# EasyEDA Pro project ProPrj_药盒0.11_2025-04-15.epro, schematic Schematic1
Board Name: Board1; Create Date: 2025-03-17; Page Name: P1; Project Name: 药盒0.11; Schematic Name: Schematic1; Update Date: 2025-03-25; Company: 嘉立创EDA; Page Size: A4; Version: V1.0
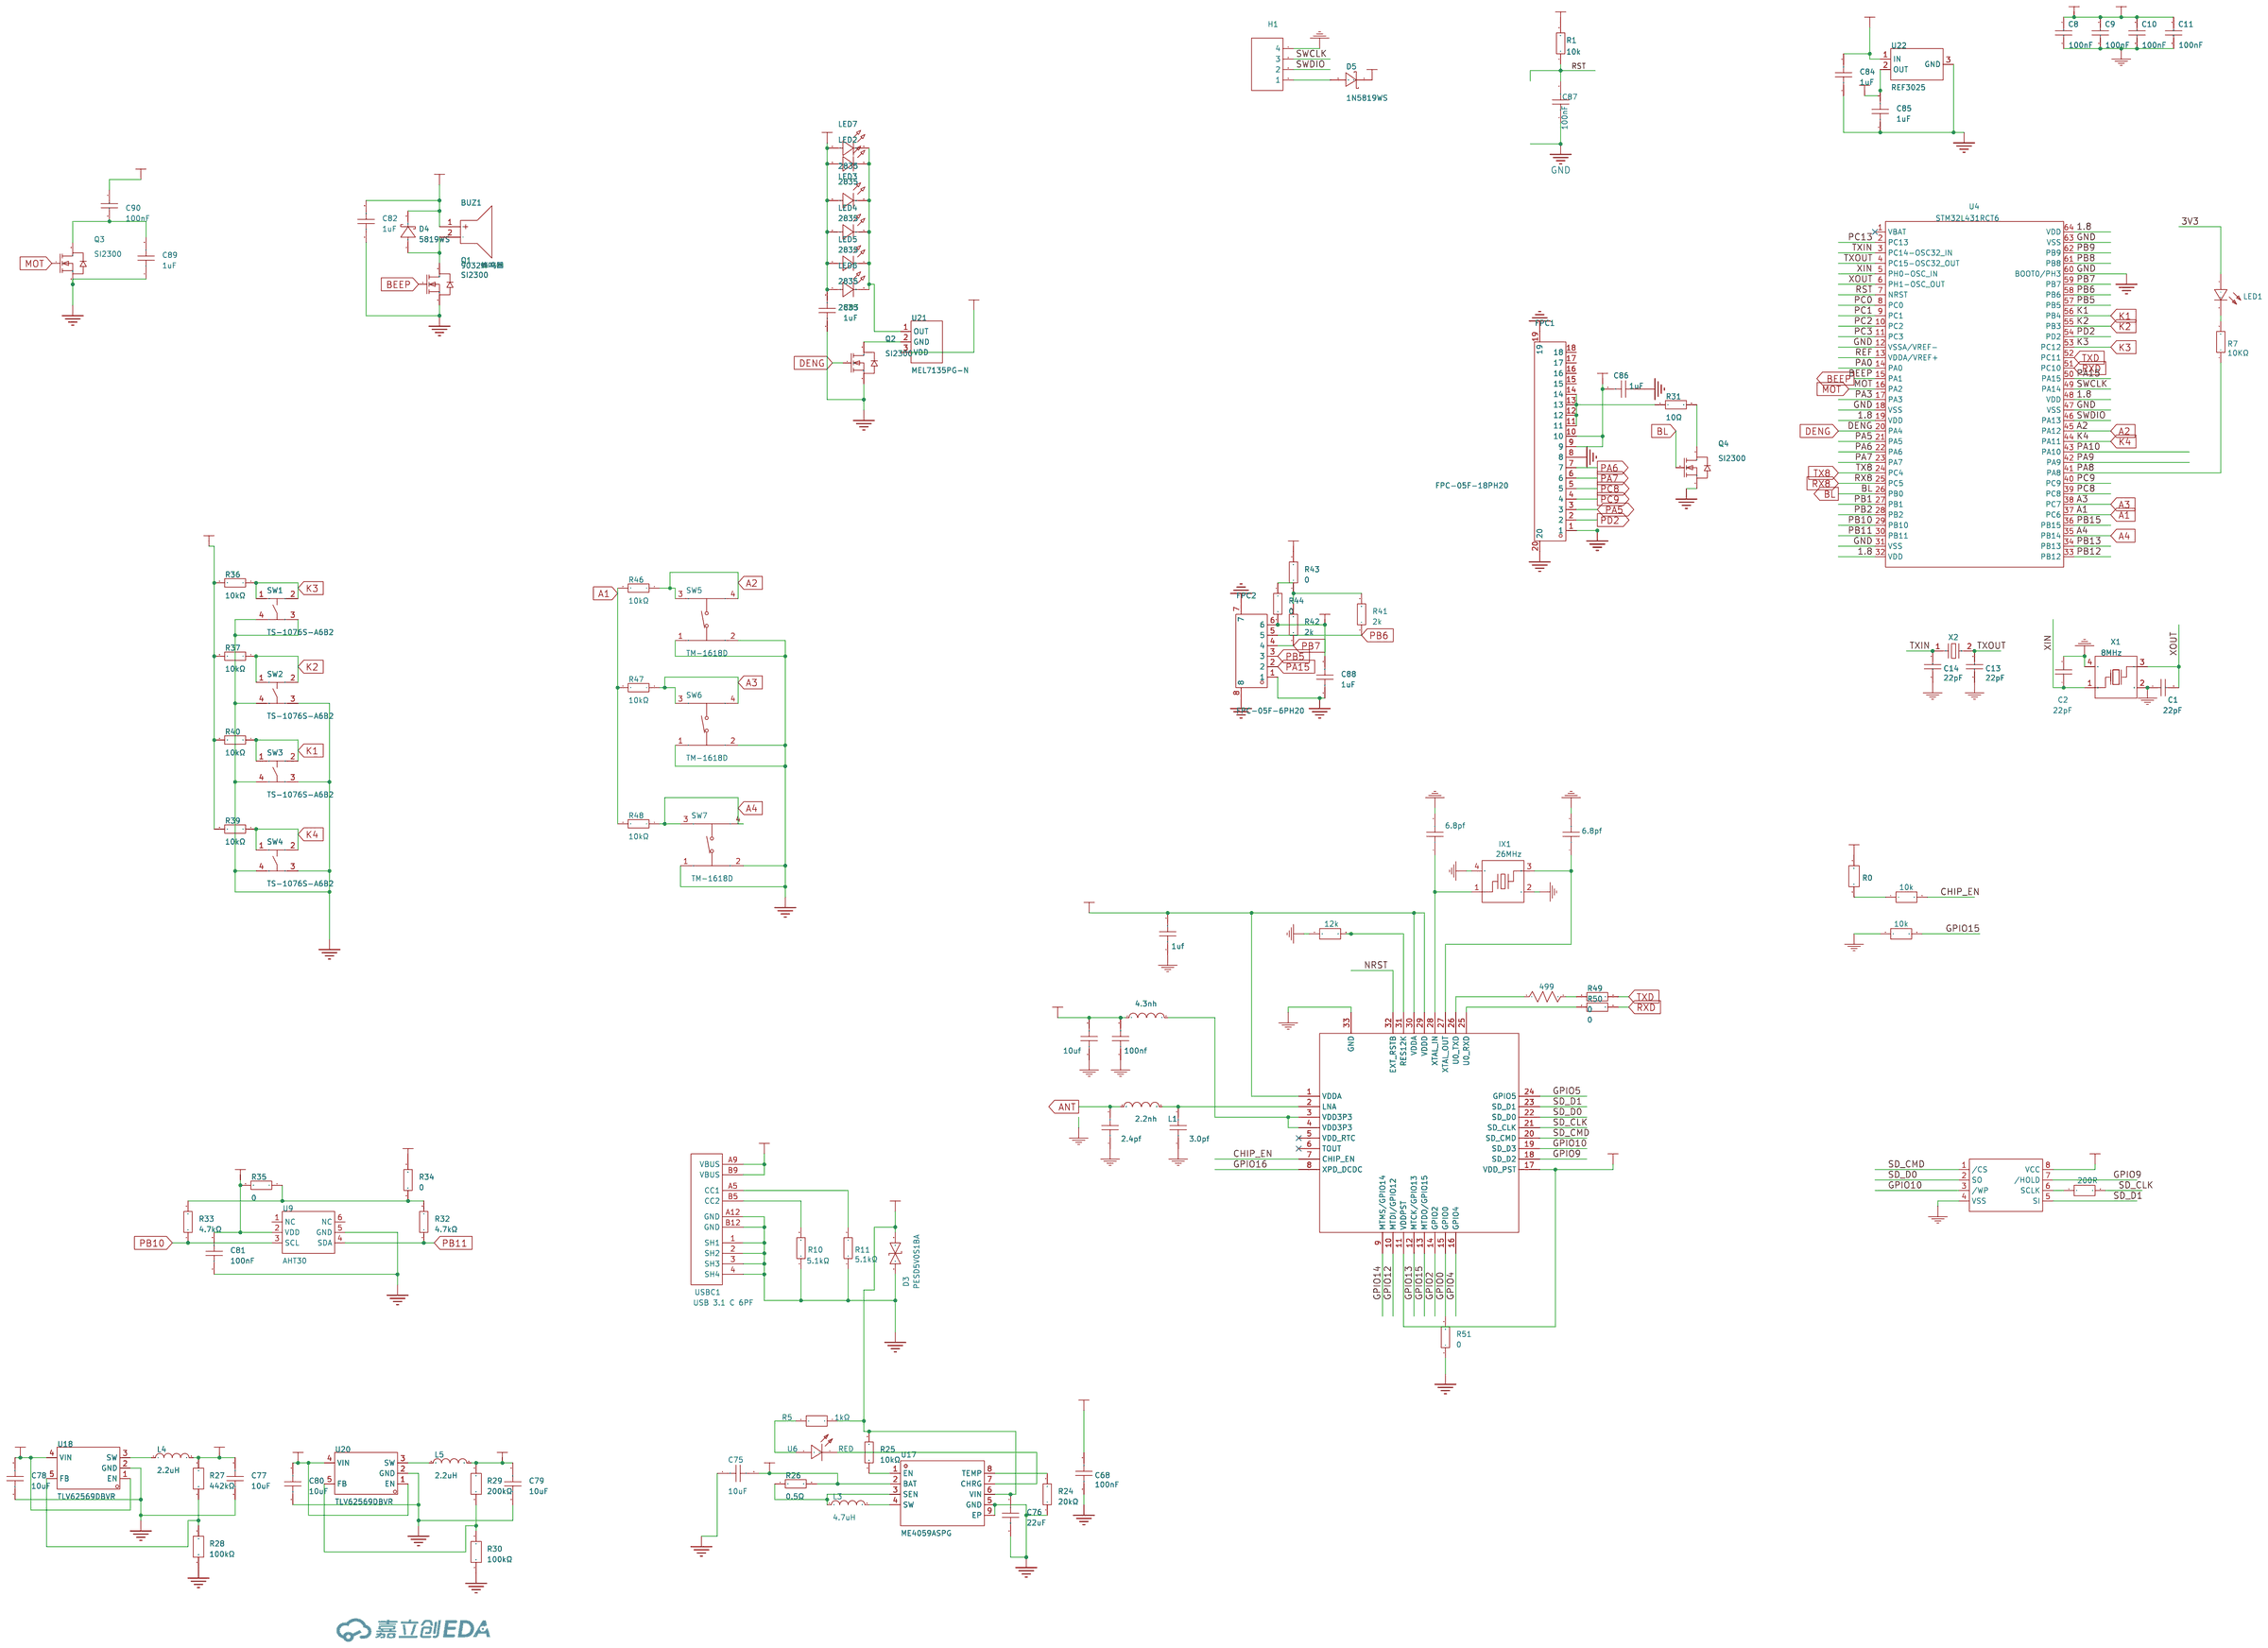
[diagram p1: schematic sheet]

## Parts
BUZ1  9032蜂鸣器  [BUZ-SMD_KLJ-90XX-3627]
C1  22pF  [C0603]
C2  22pF  [C0603]
C8  100nF  [C0603]
C9  100nF  [C0603]
C10  100nF  [C0603]
C11  100nF  [C0603]
C13  22pF  [C0603]
C14  22pF  [C0603]
C68  100nF  [C0603]
C75  10uF  [C0805]
C76  22uF  [C0805]
C77  10uF  [C0603]
C78  10uF  [C0603]
C79  10uF  [C0603]
C80  10uF  [C0603]
C81  100nF  [C0603]
C82  1uF  [C0603]
C83  1uF  [C0603]
C84  1uF  [C0603]
C85  1uF  [C0603]
C86  1uF  [C0603]
C87  100nF  [C0603]
C88  1uF  [C0603]
C89  1uF  [C0603]
C90  100nF  [C0603]
D3  PESD5V0S1BA  [SOD-323_L1.7-W1.3-LS2.5-FD-1]
D4  5819WS  [SOD-323_L1.7-W1.3-LS2.5-FD-1]
D5  1N5819WS  [SOD-323_L1.8-W1.3-LS2.5-RD]
FPC1  FPC-05F-18PH20  [FPC-SMD_18P-P0.50_FPC-05F-18PH20]
FPC2  FPC-05F-6PH20  [FPC-SMD_6P-P0.50_XUNPU_FPC-05F-6PH20]
H1  Header-Male-2.54_1x4  [HDR-TH_4P-P2.54-V-M]
IC3  1uf  [C0603]
IC4  100nf  [C0603]
IC5  10uf  [C0603]
IC6  3.0pf  [C0603]
IC7  6.8pf  [C0603]
IC8  6.8pf  [C0603]
IC9  2.4pf  [C0603]
IR1  12k  [R0603]
IR3  10k  [R0603]
IR7  10k  [R0603]
IR8  200R  [R0603]
IU1  ESP8266EX  [QFN-32_L5.0-W5.0-P0.50-BL-EP3.7]
IU2  BH25Q64BSSIG  [SOP-8_L5.3-W5.3-P1.27-LS8.0-BL]
IX1  26MHz  [CRYSTAL-SMD_4P-L3.2-W2.5-BL]
L1  2.2nh  [L0603]
L2  4.3nh  [L0603]
L3  4.7uH  [IND-SMD_L4.9-W4.4_MAPM0420F]
L4  2.2uH  [IND-SMD_L4.9-W4.4_MAPM0420F]
L5  2.2uH  [IND-SMD_L4.9-W4.4_MAPM0420F]
LED1  19-217/GHC-YR1S2/3T  [LED0603-R-RD]
LED2  2835  [LED-SMD_L3.5-W2.8_2835]
LED3  2835  [LED-SMD_L3.5-W2.8_2835]
LED4  2835  [LED-SMD_L3.5-W2.8_2835]
LED5  2835  [LED-SMD_L3.5-W2.8_2835]
LED6  2835  [LED-SMD_L3.5-W2.8_2835]
LED7  2835  [LED-SMD_L3.5-W2.8_2835]
Q1  SI2300  [SOT-23-3_L2.9-W1.3-P1.90-LS2.4-BR]
Q2  SI2300  [SOT-23-3_L2.9-W1.3-P1.90-LS2.4-BR]
Q3  SI2300  [SOT-23-3_L2.9-W1.3-P1.90-LS2.4-BR]
Q4  SI2300  [SOT-23-3_L2.9-W1.3-P1.90-LS2.4-BR]
R1  10k  [R0603]
R2  R0  [R0603]
R5  1kΩ  [R0603]
R7  10KΩ  [R0603]
R10  5.1kΩ  [R0603]
R11  5.1kΩ  [R0603]
R24  20kΩ  [R0603]
R25  10kΩ  [R0603]
R26  0.5Ω  [R0805]
R27  442kΩ  [R0603]
R28  100kΩ  [R0603]
R29  200kΩ  [R0603]
R30  100kΩ  [R0603]
R31  10Ω  [R0603]
R32  4.7kΩ  [R0603]
R33  4.7kΩ  [R0603]
R34  0  [R0603]
R35  0  [R0603]
R36  10kΩ  [R0603]
R37  10kΩ  [R0603]
R39  10kΩ  [R0603]
R40  10kΩ  [R0603]
R41  2k  [R0603]
R42  2k  [R0603]
R43  0  [R0603]
R44  0  [R0603]
R45  499  [R0603]
R46  10kΩ  [R0603]
R47  10kΩ  [R0603]
R48  10kΩ  [R0603]
R49  0  [R0603]
R50  0  [R0603]
R51  0  [R0603]
SW1  TS-1076S-A6B2  [SW-SMD_4P-L5.2-W5.2-P3.70-LS6.4]
SW2  TS-1076S-A6B2  [SW-SMD_4P-L5.2-W5.2-P3.70-LS6.4]
SW3  TS-1076S-A6B2  [SW-SMD_4P-L5.2-W5.2-P3.70-LS6.4]
SW4  TS-1076S-A6B2  [SW-SMD_4P-L5.2-W5.2-P3.70-LS6.4]
SW5  TM-1618D  [SW-SMD_TM-1618D]
SW6  TM-1618D  [SW-SMD_TM-1618D]
SW7  TM-1618D  [SW-SMD_TM-1618D]
U4  STM32L431RCT6  [LQFP-64_L10.0-W10.0-P0.50-LS12.0-BL]
U6  RED  [LED0603-RD]
U9  AHT30  [MIC-SMD_6P-L3.0-W3.0-P1.00-TL]
U17  ME4059ASPG  [SOP-8_L4.9-W3.9-P1.27-LS6.0-BL-EP]
U18  TLV62569DBVR  [SOT-23-5_L3.0-W1.7-P0.95-LS2.8-BR]
U20  TLV62569DBVR  [SOT-23-5_L3.0-W1.7-P0.95-LS2.8-BR]
U21  MEL7135PG-N  [SOT-89-3_L4.5-W2.5-P1.50-LS4.2-BR]
U22  REF3025  [SOT-23-3_L2.9-W1.3-P0.95-LS2.4-BR]
USBC1  USB 3.1 C 6PF  [USB-C-SMD_TYPE-C-USB-13]
X1  8MHz  [OSC-SMD_4P-L3.2-W2.5-BL]
X2  -  [OSC-SMD_L3.2-W1.5]

## Library data of the parts
BUZ1 = 9032蜂鸣器: Supplier Part: C9900017550; Supplier Footprint: SMD; JLCPCB Part Class: 扩展库; Supplier: LCSC
C1 C2 C13 C14 = 22pF: Supplier: LCSC; Manufacturer: FH; Manufacturer Part: 0402CG150J500NT; Supplier Part: C1548; JLCPCB Part Class: Basic Part
C8-C11 C90 = 100nF: Supplier: LCSC; Manufacturer: YAGEO; Manufacturer Part: CC0603KRX7R8BB334; Supplier Part: C107070; JLCPCB Part Class: Extended Part
C68 = 100nF: Supplier: LCSC; Supplier Part: C2846678; Manufacturer: FH(风华); Manufacturer Part: 0603B104K160NT
C75 C76 = GRM21BR61H106KE43L: 容值:10uF;精度:±10%;额定电压:50V;材质(温度系数):X5R;; LCSC Part Name: 10uF ±10% 50V; Supplier Part: C440198; Manufacturer: muRata(村田); Supplier Footprint: 0805; JLCPCB Part Class: 基础库; Datasheet: https://atta.szlcsc.com/upload/public/pdf/source/20230811/95AAE0C9AF55EDC31B7A4D8B733F534E.pdf; Supplier: LCSC; Tolerance: ±10%; Voltage Rated: 50V; Temperature Coefficient: X5R
C77-C80 = CL10A475KO8NNNC: 容值:4.7uF;精度:±10%;额定电压:16V;材质(温度系数):X5R;; LCSC Part Name: 4.7uF ±10% 16V; Supplier Part: C19666; Manufacturer: SAMSUNG(三星); Supplier Footprint: 0603; JLCPCB Part Class: 基础库; Datasheet: https://atta.szlcsc.com/upload/public/pdf/source/20160218/1457707763339.pdf; Supplier: LCSC; Tolerance: ±10%; Voltage Rated: 16V; Temperature Coefficient: X5R
C81 = CC0603KRX7R9BB104: 容值:100nF;精度:±10%;额定电压:50V;材质(温度系数):X7R;; LCSC Part Name: 100nF ±10% 50V; Supplier Part: C14663; Manufacturer: YAGEO(国巨); Supplier Footprint: 0603; JLCPCB Part Class: 基础库; Datasheet: https://atta.szlcsc.com/upload/public/pdf/source/20180910/C282072_33301C7F631E79921B82A8DAC6BCC5B3.pdf; Supplier: LCSC; Tolerance: ±10%; Voltage Rated: 50V; Temperature Coefficient: X7R
C82-C86 C88 C89 = CL10F105ZP8NNNC: 容值:1uF;精度:-20%~+80%;额定电压:10V;材质(温度系数):Y5V;; LCSC Part Name: 1uF -20%~+80% 10V; Supplier Part: C84710; Manufacturer: SAMSUNG(三星); Supplier Footprint: 0603; JLCPCB Part Class: 扩展库; Datasheet: https://atta.szlcsc.com/upload/public/pdf/source/20161228/1482890885897.pdf; Supplier: LCSC; Tolerance: -20%~+80%; Voltage Rated: 10V; Temperature Coefficient: Y5V
C87 = CC0603KRX7R9BB104: 容值:100nF;精度:±10%;额定电压:50V;材质(温度系数):X7R;; LCSC Part Name: 100nF ±10% 50V; Supplier Part: C14663; Manufacturer: YAGEO(国巨); Supplier Footprint: 0603; JLCPCB Part Class: Basic Part; Datasheet: https://atta.szlcsc.com/upload/public/pdf/source/20170116/1484561234239.pdf; Supplier: LCSC; Tolerance: ±10%; Voltage Rated: 50V; Temperature Coefficient: X7R
D3 = PESD5V0S1BA: Supplier: LCSC; Supplier Part: C2827694; Manufacturer: TECH PUBLIC(台舟); JLCPCB Part Class: Extended Part
D4 = 5819WS: 正向压降(Vf):900mV@3A;直流反向耐压(Vr):40V;整流电流:1A;; Supplier Part: C42401889; Manufacturer: MOT(仁懋); Supplier Footprint: SOD-323; Datasheet: https://atta.szlcsc.com/upload/public/pdf/source/20241129/2F7FE820FD1F1CF82116418483A2C8DE.pdf; Supplier: LCSC; Voltage - Forward(Vf@If): 900mV@3A; Voltage - DC Reverse(Vr): 40V; Current - Rectified: 1A; Reverse Leakage Current (Ir): 1mA
D5 = 1N5819WS_C191023: 正向压降(Vf):600mV@1A;直流反向耐压(Vr):40V;整流电流:1A;; LCSC Part Name: 电压:40V 电流:1A; Supplier Part: C191023; Manufacturer: Hottech(合科泰); Supplier Footprint: SOD-323; JLCPCB Part Class: 基础库; Datasheet: https://atta.szlcsc.com/upload/public/pdf/source/20220428/3CB86FD8D28D653594B4E35F9D5AEFD9.pdf; Supplier: LCSC; Forward Voltage (Vf@If): 600mV@1A; Reverse Voltage (Vr): 40V; Rectified Current: 1A
FPC1 = FPC-05F-18PH20: 锁定特性:翻盖式;触点类型:下接;触点数量:18P;间距:0.5mm;安装类型:卧贴;工作温度范围:-25℃~+85℃;; LCSC Part Name: 间距:0.5mm P数:18P 翻盖式 下接; Supplier Part: C2856802; Manufacturer: XUNPU(讯普); Supplier Footprint: SMD,P=0.5mm,卧贴; JLCPCB Part Class: 扩展库; Datasheet: https://atta.szlcsc.com/upload/public/pdf/source/20210922/C2856802_2A845D1961F33AEC1ED22CECB292335F.pdf; Supplier: LCSC; Locking Feature: 翻盖式; Contact Type: 下接; Number of Contacts: 18P; Pitch: 0.5mm; Mounting Type: 卧贴; FFC, FCB Thickness: 0.3mm; Height Above Board: 2mm; Operating Temperature Range: -25℃~+85℃
FPC2 = FPC-05F-6PH20: 锁定特性:翻盖式;触点类型:下接;触点数量:6P;间距:0.5mm;安装类型:卧贴;工作温度范围:-25℃~+85℃;; LCSC Part Name: 间距:0.5mm P数:6P 翻盖式 下接; Supplier Part: C2856796; Manufacturer: XUNPU(讯普); Supplier Footprint: SMD,P=0.5mm,卧贴; JLCPCB Part Class: 扩展库; Datasheet: https://atta.szlcsc.com/upload/public/pdf/source/20210922/16B003FB53336DDF6538142CC465AC4D.pdf; Supplier: LCSC; Locking Feature: 翻盖式; Contact Type: 下接; Number of Contacts: 6P; Pitch: 0.5mm; Mounting Type: 卧贴; FFC, FCB Thickness: 0.3mm; Height Above Board: 2mm; Operating Temperature Range: -25℃~+85℃
H1 = Header-Male-2.54_1x4: Supplier: LCSC; Manufacturer: Ckmtw; Manufacturer Part: 210S-1*4P L=11.6MMGold-plated black; Supplier Part: C124378; JLCPCB Part Class: Extended Part
IC3 = 1uf
IC4 = 100nf
IC5 = 10uf
IC6 = 3.0pf
IC7 IC8 = 6.8pf
IC9 = 2.4pf
IR1 = 12k
IR3 IR7 = 10k
IR8 = 200R
IU1 = ESP8266EX: 频率范围:2.4GHz~2.4835GHz;接口:I2C,I2S,SPI,UART;应用领域:WiFi;数据速率:72.2Mbps;灵敏度:-91dBm;典型应用频率:2.4GHz;; Supplier Part: C77967; Manufacturer: ESPRESSIF(乐鑫); Supplier Footprint: QFN-32-EP(5x5); JLCPCB Part Class: Extended Part; Datasheet: https://atta.szlcsc.com/upload/public/pdf/source/20241030/6CD178FCA06B731C281FAC067EBB44D4.pdf; Supplier: LCSC; Frequency Range: 2.4GHz~2.4835GHz; Interface: I2C,I2S,SPI,UART; Operating Voltage: 2.5V~3.6V; Applications: WiFi; Output Power: 21.5dBm; Data Rate: 72.2Mbps; Current Of Transmitting: 120mA; Sensitivity: -91dBm; Receive Current: 50mA; Typical Application Frequency: 2.4GHz; Operating Temperature: -40℃~+125℃
IU2 = BH25Q64BSSIG: Supplier Part: C691572; Supplier Footprint: SOP-8-208mil; JLCPCB Part Class: Extended Part; Datasheet: https://atta.szlcsc.com/upload/public/pdf/source/20201217/C691572_C9CCDE2BF612E79D0459CB20DE4F0C5F.pdf; Supplier: LCSC
IX1 = X322526MMB4SI: 晶振类型:贴片晶振;频率:26MHz;常温频差:±10ppm;负载电容:10pF;频率稳定度:±20ppm;; LCSC Part Name: 26MHz ±10ppm 10pF; Supplier Part: C15192; Manufacturer: YXC(扬兴晶振); Supplier Footprint: SMD3225-4P; JLCPCB Part Class: Extended Part; Datasheet: https://atta.szlcsc.com/upload/public/pdf/source/20240329/19D5F850207469550BEB00D7DFEDBC7A.pdf; Supplier: LCSC; Type: 贴片晶振; Normal temperature Frequency Tolerance: ±10ppm; Load Capacitance: 10pF; Frequency Stability: ±20ppm; Operating Temperature: -40℃~+85℃
L1 = 2.2nh
L2 = 4.3nh
L3-L5 = HA42-4R7MT: 电感值:4.7uH;精度:±20%;额定电流:2A;饱和电流(Isat):3A;; LCSC Part Name: 4.7uH ±20% 3A; Supplier Part: C2936653; Manufacturer: FH(风华); Supplier Footprint: 0420; JLCPCB Part Class: 扩展库; Datasheet: https://atta.szlcsc.com/upload/public/pdf/source/20211228/DF5AAD1C624D1DACD739A51BD94418BC.pdf; Supplier: LCSC; Tolerance: ±20%; Rated Current: 2A; Saturation Current (Isat): 3A; DC Resistance (DCR): 150mΩ
LED1 = 19-217/GHC-YR1S2/3T: Supplier: LCSC; Manufacturer: EVERLIGHT; Supplier Part: C72043; JLCPCB Part Class: Basic Part
LED2-LED7 = 2835: Supplier Part: C9900165166; Supplier Footprint: SMD; Supplier: LCSC
Q1-Q4 = SI2300: 类型:-;漏源电压(Vdss):20V;连续漏极电流(Id):6A;导通电阻(RDS(on)@Vgs,Id):55mΩ@2.5V,2A;功率(Pd):1.25W;阈值电压(Vgs(th)@Id):1V@250uA;; LCSC Part Name: N沟道增强型场效应管,电流:6.0A,耐压:20V; Supplier Part: C710316; Manufacturer: TF(拓锋); Supplier Footprint: SOT-23; JLCPCB Part Class: 扩展库; Datasheet: https://atta.szlcsc.com/upload/public/pdf/source/20201012/C710316_4958866788511FB8B8F5A96CC1F3D110.pdf; Supplier: LCSC; Drain Source Voltage (Vdss): 20V; Continuous Drain Current (Id): 6A; Drain Source On Resistance (RDS(on)@Vgs,Id): 55mΩ@2.5V,2A; Power Dissipation (Pd): 1.25W; Gate Threshold Voltage (Vgs(th)@Id): 1V@250uA; Total Gate Charge (Qg@Vgs): 16.8nC; Input Capacitance (Ciss@Vds): 888pF; Reverse Transfer Capacitance (Crss@Vds): 115pF; Operating Temperature: -55℃~+150℃
R1 = 0603WAF1002T5E: LCSC Part Name: 10KΩ(1002) ±1% 编带; Supplier Part: C25804; Manufacturer: UNI-ROYAL(厚声); Supplier Footprint: 0603; JLCPCB Part Class: Basic Part; Datasheet: https://atta.szlcsc.com/upload/public/pdf/source/20170920/C25804_1505901551523983377.pdf; Supplier: LCSC
R2 = R0
R5 = 1kΩ: Supplier: LCSC; Supplier Part: C728580; Manufacturer: YAGEO(国巨); Manufacturer Part: RT0603BRB071KL; JLCPCB Part Class: Extended Part
R7 = 10KΩ: Supplier: LCSC; Manufacturer: WALSIN; Manufacturer Part: WR06X1201FTL; Resistance: 1.2K; Supplier Part: C163838; JLCPCB Part Class: Extended Part
R10 R11 = 5.1kΩ: Supplier: LCSC; Manufacturer Part: 0603WAF5101T5E; Manufacturer: UNI-ROYAL(厚声); Supplier Part: C23186; JLCPCB Part Class: Basic Part
R24 R25 = 0603WAF2202T5E: 电阻类型:厚膜电阻;阻值:22kΩ;精度:±1%;功率:100mW;最大工作电压:75V;温度系数:±100ppm/℃;; LCSC Part Name: 22kΩ ±1% 100mW 厚膜电阻; Supplier Part: C31850; Manufacturer: UNI-ROYAL(厚声); Supplier Footprint: 0603; JLCPCB Part Class: 基础库; Datasheet: https://atta.szlcsc.com/upload/public/pdf/source/20200306/C422600_1E6D84923E4A46A82E41ADD87F860B5C.pdf; Supplier: LCSC; Type: 厚膜电阻; Tolerance: ±1%; Power(Watts): 100mW; Overload Voltage (Max): 75V; Temperature Coefficient: ±100ppm/℃; Operating Temperature Range: -55℃~+155℃
R26 = 0805W8F510KT5E: 电阻类型:厚膜电阻;阻值:5.1Ω;精度:±1%;功率:125mW;最大工作电压:150V;温度系数:±400ppm/℃;; LCSC Part Name: 5.1Ω ±1% 125mW 厚膜电阻; Supplier Part: C17724; Manufacturer: UNI-ROYAL(厚声); Supplier Footprint: 0805; JLCPCB Part Class: 基础库; Datasheet: https://atta.szlcsc.com/upload/public/pdf/source/20200306/C422600_1E6D84923E4A46A82E41ADD87F860B5C.pdf; Supplier: LCSC; Type: 厚膜电阻; Tolerance: ±1%; Power(Watts): 125mW; Overload Voltage (Max): 150V; Temperature Coefficient: ±400ppm/℃; Operating Temperature Range: -55℃~+155℃
R27 R29 = AR03BTCX2703: 电阻类型:薄膜电阻;阻值:270kΩ;精度:±0.1%;功率:100mW;最大工作电压:50V;温度系数:±25ppm/℃;; LCSC Part Name: 薄膜电阻 270kΩ ±0.1% 100mW; Supplier Part: C2828628; Manufacturer: Viking(光颉); Supplier Footprint: 0603; JLCPCB Part Class: 扩展库; Datasheet: https://atta.szlcsc.com/upload/public/pdf/source/20211009/C2828650_32843A9D611245FFE6ACF70CB68068A1.pdf; Supplier: LCSC; Type: 薄膜电阻; Tolerance: ±0.1%; Power(Watts): 100mW; Overload Voltage (Max): 50V; Temperature Coefficient: ±25ppm/℃; Operating Temperature Range: -55℃~+155℃
R28 R30 = 0603WAF6002T5E: 电阻类型:厚膜电阻;阻值:60kΩ;精度:±1%;功率:100mW;最大工作电压:75V;温度系数:±100ppm/℃;; LCSC Part Name: 60kΩ ±1% 100mW 厚膜电阻; Supplier Part: C2767205; Manufacturer: UNI-ROYAL(厚声); Supplier Footprint: 0603; JLCPCB Part Class: 扩展库; Datasheet: https://atta.szlcsc.com/upload/public/pdf/source/20200306/C422600_1E6D84923E4A46A82E41ADD87F860B5C.pdf; Supplier: LCSC; Type: 厚膜电阻; Tolerance: ±1%; Power(Watts): 100mW; Overload Voltage (Max): 75V; Temperature Coefficient: ±100ppm/℃; Operating Temperature Range: -55℃~+155℃
R31 R34 R35 R43 R44 R49-R51 = 0603WAF200KT5E: 电阻类型:厚膜电阻;阻值:2Ω;精度:±1%;功率:100mW;最大工作电压:75V;温度系数:±200ppm/℃;; LCSC Part Name: 2Ω ±1% 100mW 厚膜电阻; Supplier Part: C22977; Manufacturer: UNI-ROYAL(厚声); Supplier Footprint: 0603; JLCPCB Part Class: 基础库; Datasheet: https://atta.szlcsc.com/upload/public/pdf/source/20200306/C422600_1E6D84923E4A46A82E41ADD87F860B5C.pdf; Supplier: LCSC; Type: 厚膜电阻; Tolerance: ±1%; Power(Watts): 100mW; Overload Voltage (Max): 75V; Temperature Coefficient: ±200ppm/℃; Operating Temperature Range: -55℃~+155℃
R32 R33 R36 R37 R39-R42 R46-R48 = 0603WAF5601T5E: 电阻类型:厚膜电阻;阻值:5.6kΩ;精度:±1%;功率:100mW;最大工作电压:75V;温度系数:±100ppm/℃;; LCSC Part Name: 5.6kΩ ±1% 100mW 厚膜电阻; Supplier Part: C23189; Manufacturer: UNI-ROYAL(厚声); Supplier Footprint: 0603; JLCPCB Part Class: 基础库; Datasheet: https://atta.szlcsc.com/upload/public/pdf/source/20200306/C422600_1E6D84923E4A46A82E41ADD87F860B5C.pdf; Supplier: LCSC; Type: 厚膜电阻; Tolerance: ±1%; Power(Watts): 100mW; Overload Voltage (Max): 75V; Temperature Coefficient: ±100ppm/℃; Operating Temperature Range: -55℃~+155℃
R45 = 499
SW1-SW4 = TS-1076S-A6B2: 电路结构:单刀单掷;按钮形状:圆形按钮;作用力:180gf;安装方式:立贴;开关长度:5.2mm;开关宽度:5.2mm;开关高度:2mm;带支架:不带;机械寿命:-;; LCSC Part Name: 5.2*5.2*2mm 立贴 轻触开关; Supplier Part: C730319; Manufacturer: Yuandi(元迪); Supplier Footprint: SMD; JLCPCB Part Class: 扩展库; Datasheet: https://atta.szlcsc.com/upload/public/pdf/source/20200824/C730314_E50465657130F0F00B9B8F6AA0750946.pdf; Supplier: LCSC; Circuit: 单刀单掷; Actuator Style: 圆形按钮; Operating Force: 180gf; Mounting Style: 立贴; Switch Length: 5.2mm; Switch Width: 5.2mm; Switch Height: 2mm; Strike Gundam: 不带; Actuator/Cap Color: 黄色; Pin Style: 鸥翼型
SW5-SW7 = TM-1618D: 类型:检测开关;电路结构:双刀单掷-常开;额定电流(DC):100mA;额定电压(DC):30V;机械寿命:10万次;; LCSC Part Name: 10.15*4.9*4.5mm 贴片检测开关; Supplier Part: C2689673; Manufacturer: XKB Connectivity(中国星坤); Supplier Footprint: SMD; JLCPCB Part Class: 扩展库; Datasheet: https://atta.szlcsc.com/upload/public/pdf/source/20211011/414148E6A5FA07FB193B20A212EF48BD.pdf; Supplier: LCSC; Type: 检测开关; Circuit: 双刀单掷-常开; Actuator Style: 角拨动; Switch Length: 10.15mm; Switch Width: 4.9mm; Switch Height: 4.5mm; Contact Current (DC): 100mA; Voltage Rating (DC): 30V; Mechanical Life: 10万次; Pin Style: 鸥翼型; Operating Temperature: -40℃~+85℃
U4 = STM32L431RCT6: Supplier: LCSC; Manufacturer: STMicroelectronics; Supplier Part: C92468; JLCPCB Part Class: Extended Part
U6 = RED: Supplier: LCSC; Supplier Part: C9900005537; Manufacturer: null; Manufacturer Part: RED-LED_0603; JLCPCB Part Class: Extended Part
U9 = AHT30: Supplier Part: C9900051233; Supplier Footprint: SMD-6P; JLCPCB Part Class: 扩展库; Supplier: LCSC
U17 = ME4059ASPG: 1 节 2A 开关型锂电池充电器; LCSC Part Name: 停产; Supplier Part: C84117; Manufacturer: MICRONE(南京微盟); Supplier Footprint: SOP-8-EP; JLCPCB Part Class: 扩展库; Datasheet: https://atta.szlcsc.com/upload/public/pdf/source/20161024/1477288600992.pdf; Supplier: LCSC
U18 U20 = TLV62569DBVR: 功能类型:降压型;输出类型:可调;工作电压:2.5V~5.5V;输出电压:600mV~5.5V;输出电流:2A;; LCSC Part Name: 高效率同步降压转换器; Supplier Part: C141836; Manufacturer: TI(德州仪器); Supplier Footprint: SOT-23-5; JLCPCB Part Class: 扩展库; Datasheet: https://www.ti.com/cn/lit/gpn/tlv62569; Supplier: LCSC; Function: 降压型; Output Type: 可调; Input Voltage: 2.5V~5.5V; Output Voltage: 600mV~5.5V; Output Current: 2A; Switching Frequency: 1.5MHz; Operating Temperature: -40℃~+125℃@(TJ); Synchronous Rectification: 是; Topology: 降压式; Switch tube (built-in/external): 内置
U21 = MEL7135PG-N: 线性LED恒流驱动器; Supplier Part: C610276; Manufacturer: MICRONE(南京微盟); Supplier Footprint: SOT-89; JLCPCB Part Class: 扩展库; Datasheet: https://atta.szlcsc.com/upload/public/pdf/source/20160823/1471947524322.pdf; Supplier: LCSC
U22 = REF3025: Supplier Part: C9900010597; Supplier Footprint: SOT-23; JLCPCB Part Class: 扩展库; Supplier: LCSC
USBC1 = USB 3.1 C 6PF: Supplier: LCSC; Supplier Part: C168701; Manufacturer: 精拓金; Manufacturer Part: 918-418K2023S40005; JLCPCB Part Class: Extended Part
X1 = 8MHz: Supplier: LCSC; Manufacturer: YXC; Manufacturer Part: X322512MSB4SI; Supplier Part: C9002; JLCPCB Part Class: Basic Part
X2 = -: Supplier: LCSC; Supplier Part: C438900; Manufacturer: NDK; Manufacturer Part: NX3215SA-32.768K-STD-MUA-8; JLCPCB Part Class: Extended Part

## Nets
3V3: C77.2 C81.2 C86.2 C88.2 FPC1.9 FPC1.10 FPC2.6 IC3.2 IC4.2 IC5.2 IU1.1(VDDA) IU1.11(VDDPST) IU1.17(VDD_PST) IU1.29(VDDD) IU1.30(VDDA) IU2.8(VCC) L2.1 L4.2 LED1.1(A) R2.1 R27.2 R35.2 R44.2 U9.2(VDD)
GND: C1.1 C2.2 C8.1 C9.1 C10.1 C11.1 C13.1 C14.1 C68.2 C75.1 C76.2 C77.1 C78.1 C79.1 C80.1 C81.1 C82.1 C83.1 C84.1 C85.1 C86.1 C87.1 C88.1 C89.1 D3.1 FPC1.1 FPC1.8 FPC1.19 FPC1.20 FPC2.1 FPC2.7 FPC2.8 H1.4 IC3.1 IC4.1 IC5.1 IC6.1 IC7.2 IC8.2 IC9.1 IR1.1 IR7.1 IU1.33(GND) IU2.4(VSS) IX1.2(GND) IX1.4(GND) Q1.2(S) Q2.2(S) Q3.2(S) Q4.2(S) R10.1 R11.1 R24.1 R28.1 R30.1 R51.1 SW1.3 SW1.4 SW2.3 SW2.4 SW3.3 SW3.4 SW4.3 SW4.4 SW5.1 SW5.2 SW6.1 SW6.2 SW7.1 SW7.2 U4.12(VSSA/VREF-) U4.18(VSS) U4.31(VSS) U4.47(VSS) U4.60(BOOT0/PH3) U4.63(VSS) U9.5(GND) U17.5(GND) U17.9(EP) U18.2(GND) U20.2(GND) U22.3(GND) USBC1.1(SH1) USBC1.2(SH2) USBC1.3(SH3) USBC1.4(SH4) USBC1.A12(GND) USBC1.B12(GND) X1.2(GND) X1.4(GND)
1.8: C8.2 C9.2 C10.2 C11.2 C79.2 L5.2 R1.2 R29.2 R34.2 R36.2 R37.2 R39.2 R40.2 R43.2 U4.19(VDD) U4.32(VDD) U4.48(VDD) U4.64(VDD)
A1: R46.2 R47.2 R48.2 U4.37(PC6)
A2: R46.1 SW5.3 SW5.4 U4.45(PA12)
A3: R47.1 SW6.3 SW6.4 U4.38(PC7)
A4: R48.1 SW7.3 SW7.4 U4.35(PB14)
ANT: IC9.2 L1.1
BAT+: BUZ1.1(+) C68.1 C75.2 C78.2 C80.2 C82.2 C83.2 C84.2 C90.1 D4.2(C) D5.1(K) LED2.1(A) LED3.1(A) LED4.1(A) LED5.1(A) LED6.1(A) LED7.1(A) R26.2 U17.2(BAT) U18.1(EN) U18.4(VIN) U20.1(EN) U20.4(VIN) U21.3(VDD) U22.1(IN)
BEEP: Q1.1(G) U4.15(PA1)
BL: Q4.1(G) U4.26(PB0)
CHIP_EN: IR3.2 IU1.7(CHIP_EN)
DENG: Q2.1(G) U4.20(PA4)
GPIO0: IU1.15(GPIO0) R51.2
GPIO2: IU1.14(GPIO2)
GPIO4: IU1.16(GPIO4)
GPIO5: IU1.24(GPIO5)
GPIO9: IU1.18(SD_D2) IU2.7(/HOLD)
GPIO10: IU1.19(SD_D3) IU2.3(/WP)
GPIO12: IU1.10(MTDI/GPIO12)
GPIO13: IU1.12(MTCK/GPIO13)
GPIO14: IU1.9(MTMS/GPIO14)
GPIO15: IR7.2 IU1.13(MTDO/GPIO15)
GPIO16: IU1.8(XPD_DCDC)
K1: R40.1 SW3.1 SW3.2 U4.56(PB4)
K2: R37.1 SW2.1 SW2.2 U4.55(PB3)
K3: R36.1 SW1.1 SW1.2 U4.53(PC12)
K4: R39.1 SW4.1 SW4.2 U4.44(PA11)
MOT: Q3.1(G) U4.16(PA2)
NRST: IU1.32(EXT_RSTB)
PA0: U4.14(PA0)
PA3: U4.17(PA3)
PA5: FPC1.3 U4.21(PA5)
PA6: FPC1.7 U4.22(PA6)
PA7: FPC1.6 U4.23(PA7)
PA8: R7.1 U4.41(PA8)
PA9: U4.42(PA9)
PA10: U4.43(PA10)
PA15: FPC2.2 U4.50(PA15)
PB1: U4.27(PB1)
PB2: U4.28(PB2)
PB5: FPC2.3 U4.57(PB5)
PB6: FPC2.5 R41.1 U4.58(PB6)
PB7: FPC2.4 R42.1 U4.59(PB7)
PB8: U4.61(PB8)
PB9: U4.62(PB9)
PB10: R33.1 U4.29(PB10) U9.3(SCL)
PB11: R32.1 U4.30(PB11) U9.4(SDA)
PB12: U4.33(PB12)
PB13: U4.34(PB13)
PB15: U4.36(PB15)
PC0: U4.8(PC0)
PC1: U4.9(PC1)
PC2: U4.10(PC2)
PC3: U4.11(PC3)
PC8: FPC1.5 U4.39(PC8)
PC9: FPC1.4 U4.40(PC9)
PC13: U4.2(PC13)
PD2: FPC1.2 U4.54(PD2)
POWER_IN: C76.1 D3.2 R5.1 R25.2 U17.6(VIN) USBC1.A9(VBUS) USBC1.B9(VBUS)
REF: C85.2 U4.13(VDDA/VREF+) U22.2(OUT)
RST: C87.2 R1.1 U4.7(NRST)
RX8: U4.25(PC5)
RXD: R50.1 U4.51(PC10)
SD_CLK: IR8.2 IU1.21(SD_CLK)
SD_CMD: IU1.20(SD_CMD) IU2.1(/CS)
SD_D0: IU1.22(SD_D0) IU2.2(SO)
SD_D1: IU1.23(SD_D1) IU2.5(SI)
SWCLK: H1.3 U4.49(PA14)
SWDIO: H1.2 U4.46(PA13)
TX8: U4.24(PC4)
TXD: R49.1 U4.52(PC11)
TXIN: C14.2 U4.3(PC14-OSC32_IN) X2.1
TXOUT: C13.2 U4.4(PC15-OSC32_OUT) X2.2(GND)
XIN: C2.1 U4.5(PH0-OSC_IN) X1.1(OSC1)
XOUT: C1.2 U4.6(PH1-OSC_OUT) X1.3(OSC2)
$1N2367: D5.2(A) H1.1
$1N3753: R10.2 USBC1.B5(CC2)
$1N3756: R11.2 USBC1.A5(CC1)
$1N3989: U6.1 U17.7(CHRG)
$1N3995: R5.2 U6.2
$1N8286: R24.2 U17.8(TEMP)
$1N8329: R25.1 U17.1(EN)
$1N8901: L4.1 U18.3(SW)
$1N9596: R27.1 R28.2 U18.5(FB)
$1N9902: L5.1 U20.3(SW)
$1N9921: R29.1 R30.2 U20.5(FB)
$1N10265: BUZ1.2(-) D4.1(A) Q1.3(D)
$1N10725: LED2.2(C) LED3.2(C) LED4.2(C) LED5.2(C) LED6.2(C) LED7.2(C) U21.1(OUT)
$1N10946: Q2.3(D) U21.2(GND)
$1N13943: FPC1.11 FPC1.12 FPC1.13 FPC1.14 R31.1
$1N14140: Q4.3(D) R31.2
$1N14527: R32.2 R33.2 R34.1 R35.1
$1N17677: L3.1 R26.1 U17.3(SEN)
$1N17682: L3.2 U17.4(SW)
$1N18024: R41.2 R42.2 R43.1 R44.1
$1N27707: IC8.1 IU1.27(XTAL_OUT) IX1.3
$1N27710: IC7.1 IU1.28(XTAL_IN) IX1.1
$1N27714: IR1.2 IU1.31(RES12K)
$1N27716: IC6.2 IU1.2(LNA) L1.2
$1N27723: IU1.26(U0_TXD) R45.1
$1N27754: IU1.3(VDD3P3) IU1.4(VDD3P3) L2.2
$1N27768: IR8.1 IU2.6(SCLK)
$1N27773: IR3.1 R2.2
$1N33567: LED1.2(C) R7.2
$1N34275: C89.2 C90.2 Q3.3(D)
$1N37143: R45.2 R49.2
$1N37193: IU1.25(U0_RXD) R50.2

Not connected (* = marked no-connect by the designer): FPC1 15 16 17 18; IU1 5(VDD_RTC)* 6(TOUT)*; U4 1(VBAT)*; U9 1(NC) 6(NC)
